# EAGLE design Smoothiepanel (EAGLE 6.4)
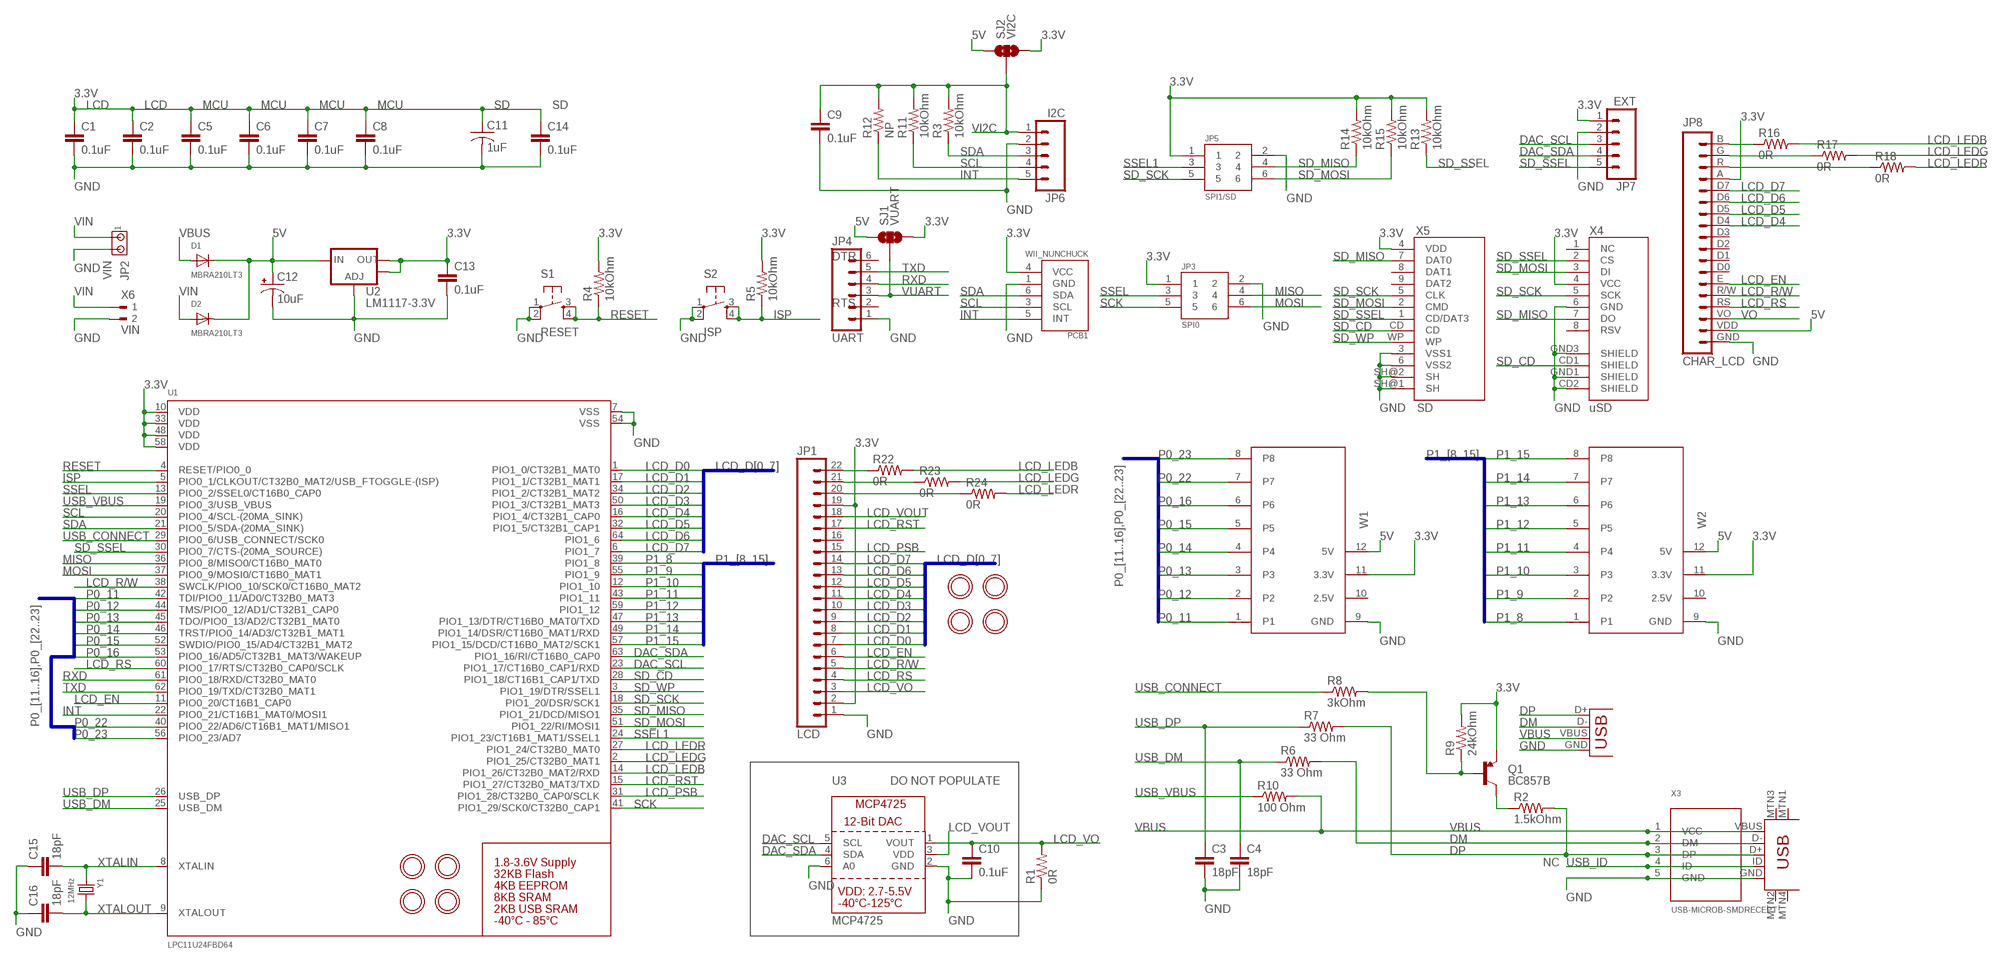
[diagram p0: schematic, sheet 1]

## Parts
C1  0.1uF  CAP0603-CAP  [0603-CAP]
C2  0.1uF  CAP0603-CAP  [0603-CAP]
C3  18pF  CAP0603-CAP  [0603-CAP]
C4  18pF  CAP0603-CAP  [0603-CAP]
C5  0.1uF  CAP0603-CAP  [0603-CAP]
C6  0.1uF  CAP0603-CAP  [0603-CAP]
C7  0.1uF  CAP0603-CAP  [0603-CAP]
C8  0.1uF  CAP0603-CAP  [0603-CAP]
C9  0.1uF  CAP0603-CAP  [0603-CAP]
C10  0.1uF  CAP0603-CAP  [0603-CAP]
C11  1uF  C-USC0805  [C0805]
C12  10uF  CAP_POL1206  [EIA3216]
C13  0.1uF  CAP0603-CAP  [0603-CAP]
C14  0.1uF  CAP0603-CAP  [0603-CAP]
C15  18pF  CAP0603-CAP  [0603-CAP]
C16  18pF  CAP0603-CAP  [0603-CAP]
D1  MBRA210LT3  DIODESMA  [SMADIODE]
D2  MBRA210LT3  DIODESMA  [SMADIODE]
JP1  LCD  M22  [1X22]
JP2  VIN  MTA02-100  [10X02MTA]
JP3  SPI0  M03X2  [2X3-SHROUDED]
JP4  UART  M06SIP  [1X06]
JP5  SPI1/SD  M03X2  [2X3-SHROUDED]
JP6  I2C  M05PTH  [1X05]
JP7  EXT  M05PTH  [1X05]
JP8  CHAR_LCD  LCD_TEXT  [TEXT_LCD]
PCB1  WII_NUNCHUCK  [WII_NUNCHUCK]
Q1  BC857B  TRANSISTOR_PNPSMD  [SOT23-3]
R1  0R  RESISTOR0603-RES  [0603-RES]
R2  1.5kOhm  RESISTOR0603-RES  [0603-RES]
R3  10kOhm  RESISTOR0603-RES  [0603-RES]
R4  10kOhm  RESISTOR0603-RES  [0603-RES]
R5  10kOhm  RESISTOR0603-RES  [0603-RES]
R6  33 Ohm  RESISTOR0603-RES  [0603-RES]
R7  33 Ohm  RESISTOR0603-RES  [0603-RES]
R8  3kOhm  RESISTOR0603-RES  [0603-RES]
R9  24kOhm  RESISTOR0603-RES  [0603-RES]
R10  100 Ohm  RESISTOR0603-RES  [0603-RES]
R11  10kOhm  RESISTOR0603-RES  [0603-RES]
R12  NP  RESISTOR0603-RES  [0603-RES]
R13  10kOhm  RESISTOR0603-RES  [0603-RES]
R14  10kOhm  RESISTOR0603-RES  [0603-RES]
R15  10kOhm  RESISTOR0603-RES  [0603-RES]
R16  0R  R-US_R0603  [R0603]
R17  0R  R-US_R0603  [R0603]
R18  0R  R-US_R0603  [R0603]
R22  0R  RESISTOR0603-RES  [0603-RES]
R23  0R  RESISTOR0603-RES  [0603-RES]
R24  0R  RESISTOR0603-RES  [0603-RES]
S1  RESET  TAC_SWITCHSMD  [TACTILE_SWITCH_SMD]
S2  ISP  TAC_SWITCHSMD  [TACTILE_SWITCH_SMD]
SJ1  VUART  SOLDERJUMPER_2WAYS  [SJ_3]
SJ2  VI2C  SOLDERJUMPER_2WAYPASTE2&3  [SJ_3_PASTE2&3]
U1  LPC11U24FBD64  LPC11U24_QFP64  [LQFP64]
U2  LM1117-3.3V  V_REG_LM1117SOT223  [SOT223]
U3  MCP4725  DAC_MCP4725  [SOT23-6]
U$4  MOUNTINGHOLE2.5_THICK  [MOUNTINGHOLE_2.5_PLATED_THICK]
U$5  MOUNTINGHOLE2.5_THICK  [MOUNTINGHOLE_2.5_PLATED_THICK]
U$6  MOUNTINGHOLE2.5_THICK  [MOUNTINGHOLE_2.5_PLATED_THICK]
U$7  MOUNTINGHOLE2.5_THICK  [MOUNTINGHOLE_2.5_PLATED_THICK]
U$8  MOUNTINGHOLE3.0THIN  [MOUNTINGHOLE_3.0_PLATEDTHIN]
U$9  MOUNTINGHOLE3.0THIN  [MOUNTINGHOLE_3.0_PLATEDTHIN]
U$10  MOUNTINGHOLE3.0THIN  [MOUNTINGHOLE_3.0_PLATEDTHIN]
U$11  MOUNTINGHOLE3.0THIN  [MOUNTINGHOLE_3.0_PLATEDTHIN]
W1  PAPILIO-WING-8BITS  [PAPILIO-WING-8BITS]
W2  PAPILIO-WING-8BITS  [PAPILIO-WING-8BITS]
X1  USB-B  USBPTH  [USB-B-PTH]
X2  mUSB  USB-MINIB-5PIN  [USB-MINIB]
X3  USB-MICROB-SMDRECEPT  [USB-MICROB-RECEPT]
X4  uSD  USD-SOCKETNEW  [MICRO-SD-SOCKET-PP]
X5  SD  SD_CARD_SOCKET4UCON  [SDCARD_4UCONN]
X6  VIN  180-2  [180-2]
Y1  12MHz  CRYSTAL2.5X2.0MM  [CRYSTAL_2.5X2]

## Nets
3.3V: C1.1 C2.1 C5.1 C6.1 C7.1 C8.1 C11.1 C13.1 C14.1 JP1.2 JP1.19 JP3.1 JP5.1 JP7.1 JP8.A PCB1.4(VCC) Q1.2(E) R4.2 R5.2 R9.2 R13.2 R14.2 R15.2 SJ1.3 SJ2.3 U1.10(VDD) U1.33(VDD) U1.48(VDD) U1.58(VDD) U2.2(OUT) U2.4(OUT) W1.11(3.3V) W2.11(3.3V) X4.4(VCC) X5.4(VDD)
5V: C12.A(+) D1.C D2.C JP8.VDD SJ1.1 SJ2.1 U2.3(IN) W1.12(5V) W2.12(5V)
DAC_SCL: JP7.3 U1.23(PIO1_17/CT16B0_CAP1/RXD) U3.5(SCL)
DAC_SDA: JP7.4 U1.63(PIO1_16/RI/CT16B0_CAP0) U3.4(SDA)
DM: R6.2 X1.D- X2.D- X3.2(DM)
DP: R2.2 R7.2 X1.D+ X2.D+ X3.3(DP)
GND: C1.2 C2.2 C3.2 C4.2 C5.2 C6.2 C7.2 C8.2 C9.2 C10.2 C11.2 C12.C(-) C13.2 C14.2 C15.1 C16.1 JP1.1 JP2.2 JP3.2 JP4.1 JP5.2 JP6.2 JP7.2 JP8.GND PCB1.1(GND) R1.1 S1.1 S1.2 S2.1 S2.2 U1.7(VSS) U1.54(VSS) U2.1(ADJ) U3.2(GND) U3.6(A0) W1.9(GND) W2.9(GND) X1.GND X2.GND X3.5(GND) X4.6(GND) X4.CD2(SHIELD) X4.GND1(SHIELD) X4.GND3(SHIELD) X5.3(VSS1) X5.6(VSS2) X5.SH@1(SH) X5.SH@2(SH) X6.2
INT: JP6.5 PCB1.5(INT) R12.1 U1.22(PIO0_21/CT16B1_MAT0/MOSI1)
ISP: R5.1 S2.3 S2.4 U1.5(PIO0_1/CLKOUT/CT32B0_MAT2/USB_FTOGGLE-(ISP))
LCD_D0: JP1.7 U1.1(PIO1_0/CT32B1_MAT0)
LCD_D1: JP1.8 U1.17(PIO1_1/CT32B1_MAT1)
LCD_D2: JP1.9 U1.34(PIO1_2/CT32B1_MAT2)
LCD_D3: JP1.10 U1.50(PIO1_3/CT32B1_MAT3)
LCD_D4: JP1.11 JP8.D4 U1.16(PIO1_4/CT32B1_CAP0)
LCD_D5: JP1.12 JP8.D5 U1.32(PIO1_5/CT32B1_CAP1)
LCD_D6: JP1.13 JP8.D6 U1.64(PIO1_6)
LCD_D7: JP1.14 JP8.D7 U1.6(PIO1_7)
LCD_EN: JP1.6 JP8.E U1.11(PIO0_20/CT16B1_CAP0)
LCD_LEDB: R16.2 R22.2 U1.14(PIO1_26/CT32B0_MAT2/RXD)
LCD_LEDB_RES: JP1.22 R22.1
LCD_LEDB_RES1: JP8.B R16.1
LCD_LEDG: R17.2 R23.2 U1.2(PIO1_25/CT32B0_MAT1)
LCD_LEDG_RES: JP1.21 R23.1
LCD_LEDG_RES1: JP8.G R17.1
LCD_LEDR: R18.2 R24.2 U1.27(PIO1_24/CT32B0_MAT0)
LCD_LEDR_RES: JP1.20 R24.1
LCD_LEDR_RES1: JP8.R R18.1
LCD_PSB: JP1.15 U1.31(PIO1_28/CT32B0_CAP0/SCLK)
LCD_R/W: JP1.5 JP8.R/W U1.38(SWCLK/PIO0_10/SCK0/CT16B0_MAT2)
LCD_RS: JP1.4 JP8.RS U1.60(PIO0_17/RTS/CT32B0_CAP0/SCLK)
LCD_RST: JP1.17 U1.15(PIO1_27/CT32B0_MAT3/TXD)
LCD_VO: C10.1 JP1.3 R1.2 U3.1(VOUT)
LCD_VOUT: JP1.18 U3.3(VDD)
MISO: JP3.4 U1.36(PIO0_8/MISO0/CT16B0_MAT0)
MOSI: JP3.6 U1.37(PIO0_9/MOSI0/CT16B0_MAT1)
P0_11: U1.42(TDI/PIO0_11/AD0/CT32B0_MAT3) W1.1
P0_12: U1.44(TMS/PIO0_12/AD1/CT32B1_CAP0) W1.2
P0_13: U1.45(TDO/PIO0_13/AD2/CT32B1_MAT0) W1.3
P0_14: U1.46(TRST/PIO0_14/AD3/CT32B1_MAT1) W1.4
P0_15: U1.52(SWDIO/PIO0_15/AD4/CT32B1_MAT2) W1.5
P0_16: U1.53(PIO0_16/AD5/CT32B1_MAT3/WAKEUP) W1.6
P0_22: U1.40(PIO0_22/AD6/CT16B1_MAT1/MISO1) W1.7
P0_23: U1.56(PIO0_23/AD7) W1.8
P1_8: U1.39(PIO1_8) W2.1
P1_9: U1.55(PIO1_9) W2.2
P1_10: U1.12(PIO1_10) W2.3
P1_11: U1.43(PIO1_11) W2.4
P1_12: U1.59(PIO1_12) W2.5
P1_13: U1.47(PIO1_13/DTR/CT16B0_MAT0/TXD) W2.6
P1_14: U1.49(PIO1_14/DSR/CT16B0_MAT1/RXD) W2.7
P1_15: U1.57(PIO1_15/DCD/CT16B0_MAT2/SCK1) W2.8
RESET: R4.1 S1.3 S1.4 U1.4(RESET/PIO0_0)
RXD: JP4.4 U1.61(PIO0_18/RXD/CT32B0_MAT0)
SCK: JP3.5 U1.41(PIO1_29/SCK0/CT32B0_CAP1)
SCL: JP6.4 PCB1.3(SCL) R11.1 U1.20(PIO0_4/SCL-(20MA_SINK))
SD_CD: U1.28(PIO1_18/CT16B1_CAP1/TXD) X4.CD1(SHIELD) X5.CD
SD_MISO: JP5.4 R14.1 U1.35(PIO1_21/DCD/MISO1) X4.7(DO) X5.7(DAT0)
SD_MOSI: JP5.6 R15.1 U1.51(PIO1_22/RI/MOSI1) X4.3(DI) X5.2(CMD)
SD_SCK: JP5.5 U1.18(PIO1_20/DSR/SCK1) X4.5(SCK) X5.5(CLK)
SD_SSEL: JP7.5 R13.1 U1.30(PIO0_7/CTS-(20MA_SOURCE)) X4.2(CS) X5.1(CD/DAT3)
SD_WP: U1.3(PIO1_19/DTR/SSEL1) X5.WP
SDA: JP6.3 PCB1.6(SDA) R3.1 U1.21(PIO0_5/SDA-(20MA_SINK))
SSEL: JP3.3 U1.13(PIO0_2/SSEL0/CT16B0_CAP0)
SSEL1: JP5.3 U1.24(PIO1_23/CT16B1_MAT1/SSEL1)
TXD: JP4.5 U1.62(PIO0_19/TXD/CT32B0_MAT1)
USB_CONNECT: R8.1 U1.29(PIO0_6/USB_CONNECT/SCK0)
USB_CONNECT_BASE: Q1.1(B) R8.2 R9.1
USB_CONNECT_COLLECTOR: Q1.3(C) R2.1
USB_DM: C4.1 R6.1 U1.25(USB_DM)
USB_DP: C3.1 R7.1 U1.26(USB_DP)
USB_ID: X2.ID X3.4(ID)
USB_VBUS: R10.1 U1.19(PIO0_3/USB_VBUS)
VBUS: D1.A R10.2 X1.VBUS X2.VBUS X3.1(VCC)
VI2C: C9.1 JP6.1 R3.2 R11.2 R12.2 SJ2.2
VIN: D2.A JP2.1 X6.1
VO: JP8.VO
VUART: JP4.3 SJ1.2
XTALIN: C15.2 U1.8(XTALIN) Y1.1
XTALOUT: C16.2 U1.9(XTALOUT) Y1.3
Unconnected: JP1.16 JP4.2 JP4.6 JP8.D0 JP8.D1 JP8.D2 JP8.D3 W1.10(2.5V) W2.10(2.5V) X2.MTN1(MTN2) X2.MTN2(MTN3) X2.MTN3(MTN1) X2.MTN4 X4.1(NC) X4.8(RSV) X5.8(DAT1) X5.9(DAT2)

## Buses
P1_[8..15]
LCD_D[0..7]
P0_[11..16],P0_[22..23]

## Notes on the sheet
- LCD | LCD | MCU | MCU | MCU | MCU | SD | SD
- DTR
- RTS
- DO NOT POPULATE
- NC

## Library data of the parts
C1-C10 C13-C16 = SparkFun-Capacitors:CAP: Capacitor Standard 0603 ceramic capacitor, and 0.1" leaded capacitor.
C11 = resistor:C-US: CAPACITOR, American symbol
C12 = SparkFun:CAP_POL: Capacitor Polarized These are standard SMD and PTH capacitors. Normally 10uF, 47uF, and 100uF in electrolytic and tantalum varieties. Always verify the external diameter of the through hole cap, it varies with capacity, voltage, and manufacturer. The EIA devices should be standard.
D1 D2 = microbuilder:DIODE: Diode SMADIODE - SMA Surface Mount Package 20V 1A Schottky Diode Digikey (500mV @ 1A, 500uA Vr @ 20V): 641-1014-6-ND 10V 2A Schottky Diode Digikey (350mV @ 2A, 700uA Vr @ 10V): MBRA210LT3 SOD-123 30V 200mA (800mV Vf, 2uA Vr @ 25V) Schottky Diode (very fast switching for boost, etc.) - Digikey: BAT54T1GOSTR-ND 30V 500mA (430mV Vf, 130uA Vr @ 30V) Schottky Diode - Digikey: B0530W-FDICT-ND MBR120 1A 20V (0.34Vf) Schottky Diode - Digikey: MBR120VLSFT1GOSCT-ND SOD-323 10V 570mA (380mV Vf, 3ns) Schottky Diode - Digikey: ZLLS410CT-ND 1N4148WS - 75V 150mA (1V Vf @ 10mA, 4ns) Simple Diode - Digikey: 1N4148WSFSCT-ND, Mouser: 512-1N4148WS SOD-523 BAT54 30V 200mA Schottky (0.8 Vf @ 100mA, 5ns) - Digikey: BAT54XV2CT-ND 30V 30mA Schottky Diode (RB751S-40TE61) - Digikey: RB751S-40TE61CT-ND SOT23-R/W - SOT23 Package (R = Solder Paste/Reflow Ovens, W = Hand-Soldering) BAT54Film 40V 300mA - Digikey: 497-7162-1-ND DO-1N4148 Through Hole Small Current Diode (any model)
JP1 = logxen:M22
JP2 = con-amp:MTA02-100: AMP connector
JP3 JP5 = SparkFun-Connectors:M03X2: Shrouded 2x3 .1" header, with keying.
JP4 = SparkFun-Connectors:M06: Header 6 Standard 6-pin 0.1" header. Use with straight break away headers (SKU : PRT-00116), right angle break away headers (PRT-00553), swiss pins (PRT-00743), machine pins (PRT-00117), and female headers (PRT-00115). Molex polarized connector foot print use with SKU : PRT-08094 with associated crimp pins and housings. NOTES ON THE VARIANTS LOCK and LOCK_LONGPADS... This footprint was designed to help hold the alignment of a through-hole component (i.e. 6-pin header) while soldering it into place. You may notice that each hole has been shifted either up or down by 0.005 of an inch from it's more standard position (which is a perfectly straight line). This slight alteration caused the pins (the squares in the middle) to touch the edges of the holes. Because they are alternating, it causes a "brace" to hold the component in place. 0.005 has proven to be the perfect amount of "off-center" position when using our standard breakaway headers. Although looks a little odd when you look at the bare footprint, once you have a header in there, the alteration is very hard to notice. Also, if you push a header all the way into place, it is covered up entirely on the bottom side. This idea of altering the position of holes to aid alignment will be further integrated into the Sparkfun Library for other footprints. It can help hold any component with 3 or more connection pins.
JP6 JP7 = SparkFun-Connectors:M05: Header 5 Standard 5-pin 0.1" header. Use with straight break away headers (SKU : PRT-00116), right angle break away headers (PRT-00553), swiss pins (PRT-00743), machine pins (PRT-00117), and female headers (PRT-00115). Molex polarized connector foot print use with SKU : PRT-08230 with associated crimp pins and housings.
JP8 = logxen:LCD_TEXT
PCB1 = logxen:WII_NUNCHUCK
Q1 = SparkFun-DiscreteSemi:TRANSISTOR_PNP: Generic PNP BJT. Double check pinouts against datasheets- not all devices are the same!
R1-R15 R22-R24 = SparkFun-Resistors:RESISTOR: Resistor Basic schematic elements and footprints for 0603, 1206, and PTH resistors.
R16-R18 = resistor:R-US_: RESISTOR, American symbol
S1 S2 = SparkFun-Electromechanical:TAC_SWITCH: Momentary Switch Button commonly used for reset or general input. Spark Fun Electronics SKU : COM-00097
SJ1 = SparkFun:SOLDERJUMPER_2WAY: Solder Jumper 2 way solder jumper
SJ2 = SparkFun-Passives:SOLDERJUMPER_2WAY: Solder Jumper 2 way solder jumper
U1 = microbuilder:LPC11U24_QFP64: LPC11U24 - ARM Cortex M0 50MHz MCU Supply: 1.8-3.6V Flash: 32KB EEPROM: 4KB SRAM: 8KB + 2KB USB Temp: -40°C - 85°C
U2 = SparkFun:V_REG_LM1117: Voltage Regulator LM1117 Standard adjustable voltage regulator but in SMD form. Spark Fun Electronics SKU : COM-00595
U3 = microbuilder:DAC_MCP4725: MCP4725 - 12-Bit I2C DAC with on-board EEPROM Settling Time: 6 µs 2.7-5.5V Supply 100kHz, 400kHz, 3.4 Mbps I²C EEPROM can be used to store a specific output voltage which will be set coming out of reset I²C Address: 1100 A2 A1 A0 A0 is set via the A0 pin, A2 and A1 are hard-wired on the chip depending on the model chosen: Part Number A2 A1 Code MCP4725A0T-E/CH 0 0 AJNN MCP4725A1T-E/CH 0 1 APNN MCP4725A2T-E/CH 1 0 AQNN MCP4725A3T-E/CH 1 1 ARNN
U$4-U$11 = microbuilder:MOUNTINGHOLE: Mounting Hole For #2 screws (0.086"/2.18mm width, 0.094"/2.4mm hole) use 2.5mm
W1 W2 = logxen:PAPILIO-WING-8BITS
X1 = SparkFun-Connectors:USB: USB Connectors USB-B-PTH is fully proven SKU : PRT-00139/CONN-08278 USB-miniB is fully proven SKU : PRT-00587 USB-A-PCB is untested. USB-A-H is throughly reviewed, but untested. Spark Fun Electronics SKU : PRT-00437 USB-B-SMT is throughly reviewed, but untested. Needs silkscreen touching up. USB-A-S has not been used/tested USB-MB-H has not been used/tested USB-MICROB has been used. CONN-09505; PROD_ID: CONN-08278
X2 = SparkFun-Connectors:USB-MINIB: Mini-USB "B" connector with 5th pin broken out. Created new symbol breaking out 5th "ID" pin in mini/micro USB connector spec. See: http://en.wikipedia.org/wiki/Mini_usb#Cables. Uses same footprint as 4-pin symbol. Also added pins to connect to mounting / shield pads if required (probably not generally needed as signals aren't shielded once they leave the connector).
X3 = logxen:USB-MICROB-SMDRECEPT
X4 = SparkFun-Connectors:USD-SOCKET: microSD Socket Push-push type uSD socket. Schematic element and footprint production proven. Spark Fun Electronics SKU : PRT-00127. tDoc lines correctly indicate media card edge positions when inserting (unlocked, locked, depressed).
X5 = SparkFun-Connectors:SD_CARD_SOCKET: SD Memory Card Connector, push-push normal type, CD enable, WP enable
X6 = con-weidmueller-sl35:180-2: WEIDMUELLER CLAMP CONNECTOR; OC_FARNELL: unknown; OC_NEWARK: unknown
Y1 = microbuilder:CRYSTAL: Crystals HC49UP - Surface Mount Crystal 4.0MHz 18pF +/-30ppm Surface Mount Crystal [Digikey: 535-9857-1-ND] 12.0 MHz Surface Mount Crystal [Digikey: 535-9869-6-ND] 25.0 MHz Surface Mount Crystal [Digikey: 535-9078-1-ND] 2.5 x 2.0mm - MEMs SMT Crystal 16.0 MHz 10pF 20ppm 2.5 x 2.0mm Crystal [Digikey -40-85°C: 535-10923-1-ND] 3.2 x 2.5mm - MEMs SMT Crystal 12.0 MHz 8pF 15ppm 3.2 x 2.5mm Crystal [Digikey: -10-70°C: 644-1047-1-ND -40-125°C: 644-1128-1-ND] 16.0 MHz 8pF 15ppm 3.2 x 2.5mm Crystal [Digikey: -10-70°C: 644-1049-1-ND -40-125°C: 644-1129-2-ND] 16.0 MHz 10pF 10ppm 3.2 x 2.5mm Crystal [Digikey: 644-1100-1-ND] 27.12 MHz 18pF 30ppm 3.2 x 2.5mm Crystal [Digikey: 887-1424-1-ND] 27.12MHz 10pF 10ppm 3.2 x 2.5mm Crystal [Digikey: 887-1329-1-ND] 4.9 x 1.8mm - MEMs SMT Crystal 32.768 KHz 12.5pF 20ppm 4.9 x 1.8mm Crystal [Digikey: SE2415CT-ND] 8.0 x 3.8mm - Surface Mount Crystal 32.768kHz 12.5pF 20ppm -40°C-85°C [Digikey: 535-9166-2-ND] Cylinder 32.768KHz Cylinder Crystal (2x6mm body) [Ex. Digikey: 300-8341-2-ND]

## Board
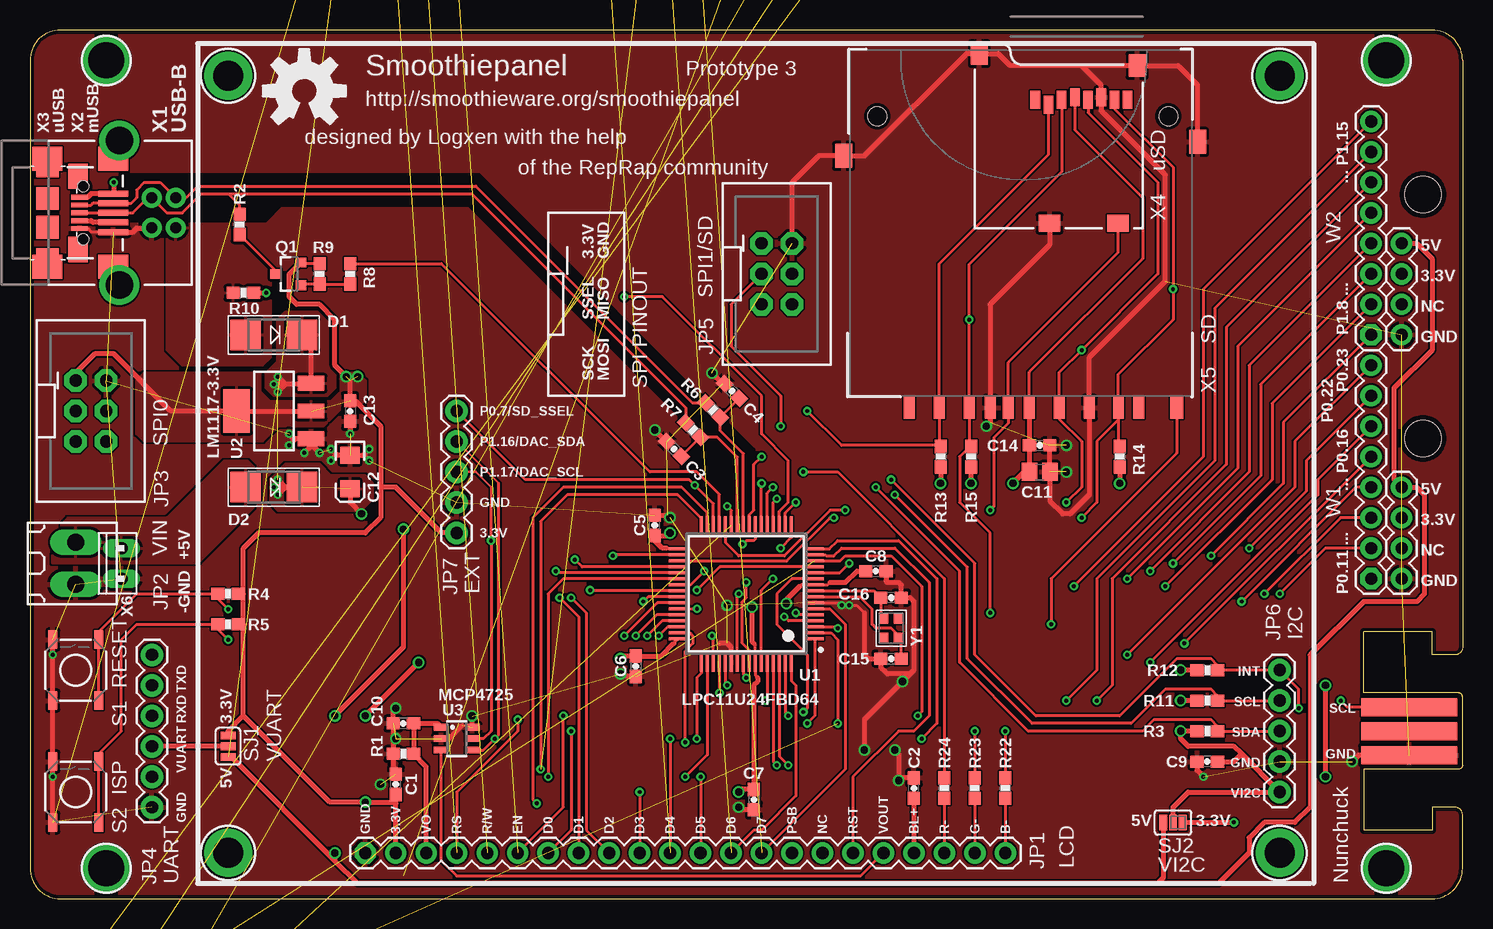
[diagram p1: board, top side]
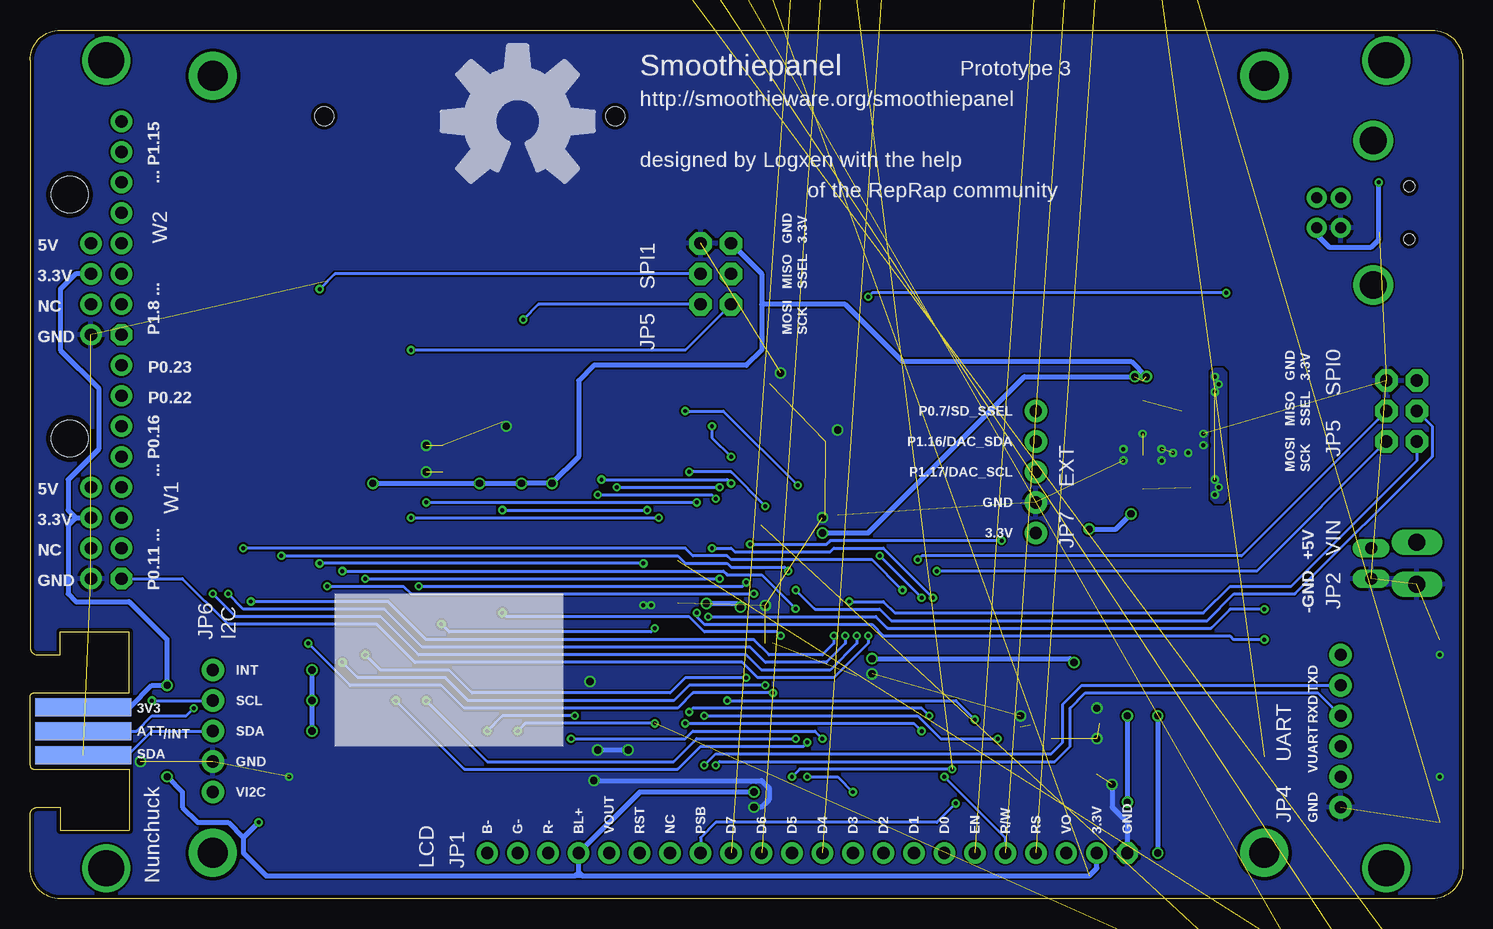
[diagram p2: board, bottom side, seen from below]

Size 119.38 x 72.39 mm. Coordinates in mm from the lower left corner, seen from the top.
Outline: 119.38,20.95 119.38,69.85 arc90 116.84,72.39 2.54,72.39 arc90 0,69.85 0,2.54 arc90 2.54,0 116.84,0 arc90 119.38,2.54 119.38,6.99
Copper layers (1*16): Top 0.0356mm / dielectric 1.5011mm / Bottom 0.0356mm
Design rules "LaenPCBOrder *": minimum track width 6mil, minimum drill 13mil, track to track 6mil, track to pad 6mil, pad to pad 6mil, via to via 6mil, smd to smd 6mil, copper to edge 12mil, drill to drill 6mil, minimum pad ring 7mil, minimum via ring 7mil, stop-mask expansion 5mil, vias tented up to drill 24mil, thermal gap 10mil

### Footprints (pad centres in the part's own frame; a part is rotated, then mirrored left to right if it is on the bottom)
0603-CAP = smd 1.1 x 1: 1 -0.85,0; 2 0.85,0
C0805 = smd 1.3 x 1.5: 1 -0.85,0; 2 0.85,0
EIA3216 = smd 1.4 x 1.6: A 1.4,0; C -1.4,0
SMADIODE = smd 2.54 x 2.54: A 2.349,0; C -2.349,0
1X22 = drill 1.016 pad 1.778 octagon: 1 0,0 | drill 1.016 pad 1.778: 2 2.54,0; 3 5.08,0; 4 7.62,0; 5 10.16,0; 6 12.7,0; 7 15.24,0; 8 17.78,0; 9 20.32,0; 10 22.86,0; 11 25.4,0; 12 27.94,0; 13 30.48,0; 14 33.02,0; 15 35.56,0; 16 38.1,0; 17 40.64,0; 18 43.18,0; 19 45.72,0; 20 48.26,0; 21 50.8,0; 22 53.34,0
10X02MTA = drill 1.016 long: 1 1.27,0; 2 -1.27,0
2X3-SHROUDED = drill 1.016 pad 1.88 octagon: 1 -1.27,2.54; 2 1.27,2.54; 3 -1.27,0; 4 1.27,0; 5 -1.27,-2.54; 6 1.27,-2.54
1X06 = drill 1.016 pad 1.88: 1 0,0; 2 2.54,0; 3 5.08,0; 4 7.62,0; 5 10.16,0; 6 12.7,0
1X05 = drill 1.016 pad 1.88: 1 0,0; 2 2.54,0; 3 5.08,0; 4 7.62,0; 5 10.16,0
TEXT_LCD = drill 1.016 pad 1.88: A 35.56,0; B 43.18,0; D0 15.24,0; D1 17.78,0; D2 20.32,0; D3 22.86,0; D4 25.4,0; D5 27.94,0; D6 30.48,0; D7 33.02,0; E 12.7,0; G 40.64,0; R 38.1,0; R/W 10.16,0; RS 7.62,0; VDD 2.54,0; VO 5.08,0 | drill 1.016 pad 1.88 square: GND 0,0
WII_NUNCHUCK = smd 8 x 1.5: 1 4.445,2; 2 4.445,0; 3 4.445,-2 | smd 8 x 1.5 bottom: 4 4.445,-2; 5 4.445,0; 6 4.445,2
SOT23-3 = smd 0.8 x 0.9: 1 -0.95,-1; 2 0.95,-1; 3 0,1.1
0603-RES = smd 1.1 x 1: 1 -0.85,0; 2 0.85,0
R0603 = smd 1 x 1.1: 1 -0.85,0; 2 0.85,0
TACTILE_SWITCH_SMD = smd 1.524 x 0.762: 1 -2.54,1.905; 2 2.54,1.905; 3 -2.54,-1.905; 4 2.54,-1.905
SJ_3 = smd 0.635 x 1.27: 1 -0.889,0; 2 0,0; 3 0.889,0
SJ_3_PASTE2&3 = smd 0.635 x 1.27: 1 -0.813,0; 2 0,0; 3 0.813,0
LQFP64 = smd 1.55 x 0.25: 1 -5.7,3.75; 2 -5.7,3.25; 3 -5.7,2.75; 4 -5.7,2.25; 5 -5.7,1.75; 6 -5.7,1.25; 7 -5.7,0.75; 8 -5.7,0.25; 9 -5.7,-0.25; 10 -5.7,-0.75; 11 -5.7,-1.25; 12 -5.7,-1.75; 13 -5.7,-2.25; 14 -5.7,-2.75; 15 -5.7,-3.25; 16 -5.7,-3.75; 33 5.7,-3.75; 34 5.7,-3.25; 35 5.7,-2.75; 36 5.7,-2.25; 37 5.7,-1.75; 38 5.7,-1.25; 39 5.7,-0.75; 40 5.7,-0.25; 41 5.7,0.25; 42 5.7,0.75; 43 5.7,1.25; 44 5.7,1.75; 45 5.7,2.25; 46 5.7,2.75; 47 5.7,3.25; 48 5.7,3.75 | smd 0.25 x 1.55: 17 -3.75,-5.7; 18 -3.25,-5.7; 19 -2.75,-5.7; 20 -2.25,-5.7; 21 -1.75,-5.7; 22 -1.25,-5.7; 23 -0.75,-5.7; 24 -0.25,-5.7; 25 0.25,-5.7; 26 0.75,-5.7; 27 1.25,-5.7; 28 1.75,-5.7; 29 2.25,-5.7; 30 2.75,-5.7; 31 3.25,-5.7; 32 3.75,-5.7; 49 3.75,5.7; 50 3.25,5.7; 51 2.75,5.7; 52 2.25,5.7; 53 1.75,5.7; 54 1.25,5.7; 55 0.75,5.7; 56 0.25,5.7; 57 -0.25,5.7; 58 -0.75,5.7; 59 -1.25,5.7; 60 -1.75,5.7; 61 -2.25,5.7; 62 -2.75,5.7; 63 -3.25,5.7; 64 -3.75,5.7
SOT223 = smd 1.219 x 2.235: 1 -2.311,-3.099; 2 0,-3.099; 3 2.311,-3.099 | smd 3.6 x 2.2: 4 0,3.099
SOT23-6 = smd 0.55 x 1.2: 1 -0.95,-1.3; 2 0,-1.3; 3 0.95,-1.3; 4 0.95,1.3; 5 0,1.3; 6 -0.95,1.3
MOUNTINGHOLE_2.5_PLATED_THICK = drill 2.5 pad 4: P$1 0,0
MOUNTINGHOLE_3.0_PLATEDTHIN = drill 3 pad 3.6: P$1 0,0
PAPILIO-WING-8BITS = drill 1.016 pad 1.778 octagon: 1 0,0 | drill 1.016 pad 1.778: 2 0,2.54; 3 0,5.08; 4 0,7.62; 5 0,10.16; 6 0,12.7; 7 0,15.24; 8 0,17.78; 9 2.54,0; 10 2.54,2.54; 11 2.54,5.08; 12 2.54,7.62 | hole 3.048: 4.318,11.684
USB-B-PTH = drill 0.914 pad 1.676: D+ 0,1.25; D- 1.981,1.25; GND 0,-1.25; VBUS 1.981,-1.25 | drill 2.286: S1 -2.718,-6.02; S2 -2.718,6.02
USB-MINIB = smd 2.5 x 0.5: D+ 2.5,0; D- 2.5,0.8; GND 2.5,-1.6; ID 2.5,-0.8; VBUS 2.5,1.6 | smd 2.5 x 2: MTN1 -3,4.5; MTN2 2.5,4.5; MTN3 -3,-4.5; MTN4 2.5,-4.5 | hole 0.9: 0,2.2; 0,-2.2
USB-MICROB-RECEPT = smd 0.4 x 1.35: 1 -1.3,4.125; 2 -0.65,4.125; 3 0,4.125; 4 0.65,4.125; 5 1.3,4.125 | smd 2.1 x 1.6: P$1 3.05,4; P$2 -3.05,4 | smd 1.8 x 1.9: P$3 -3.85,1.45; P$4 3.85,1.45 | smd 1.9 x 1.9: P$5 -1.2,1.45; P$6 1.2,1.45
MICRO-SD-SOCKET-PP = smd 0.8 x 1.5: 1 -8.94,10.7; 2 -7.84,10.3; 3 -6.74,10.7; 4 -5.64,10.9; 5 -4.54,10.7; 6 -3.44,10.9; 7 -2.34,10.7; 8 -1.24,10.7 | smd 1.8 x 1.4: CD1 -2.05,0.4; CD2 -7.75,0.4 | smd 1.4 x 1.9: GND1 -13.6,14.55; GND3 -0.45,13.55
SDCARD_4UCONN = smd 1.8 x 0.9: 1 -1,6.77; 2 -1,4.27; 3 -1,2.52; 4 -1,-0.73; 5 -1,-3.23; 6 -1,-5.73; 7 -1,-8.15; 8 -1,-9.85; 9 -1,9.27; CD -1,1.02 | smd 2 x 1.4: SH@1 20,14.75; SH@2 21.15,-14.75 | smd 1.8 x 1.1: WP -1,-13 | hole 1.55: 23.3,11.94; 23.3,-12.32
180-2 = drill 1.422 long: 1 -1.75,0; 2 1.75,0
CRYSTAL_2.5X2 = smd 0.9 x 0.8: 1 -0.825,-0.625; 2 0.825,-0.625; 3 0.825,0.625; 4 -0.825,0.625

### Placement (x,y rotation side)
C1  30.48,9.53 90 top
C2  73.66,9.21 90 top
C3  53.67,37.48 135 top
C4  58.5,42.3 135 top
C5  52.07,31.11 90 top
C6  50.48,19.37 270 top
C7  60.33,8.26 270 top
C8  70.48,27.3 0 top
C9  98.11,11.43 180 top
C10  31.11,14.61 180 top
C11  84.14,35.56 0 top
C12  26.67,35.56 270 top
C13  26.67,40.64 270 top
C14  84.14,37.78 0 top
C15  71.75,20 0 top
C16  71.75,25.08 180 top
D1  20.32,46.99 180 top
D2  20.32,34.29 180 top
JP1  27.94,3.81 0 top
JP2  7.62,27.94 90 top
JP3  5.08,40.64 0 top
JP4  10.16,7.62 90 top
JP5  62.23,52.07 0 top
JP6  104.14,8.89 90 top
JP7  35.56,30.48 90 top
JP8  22.86,77.47 0 top  (outside the outline)
PCB1  119.38,13.97 180 top
Q1  21.59,52.07 90 top
R1  31.11,12.06 0 top
R2  17.46,56.2 90 top
R3  98.11,13.97 180 top
R4  16.51,25.4 0 top
R5  16.51,22.86 0 top
R6  56.93,40.73 135 top
R7  55.24,39.05 135 top
R8  26.67,52.07 270 top
R9  24.13,52.07 90 top
R10  17.78,50.48 180 top
R11  98.11,16.51 180 top
R12  98.11,19.05 180 top
R13  75.88,36.83 270 top
R14  90.81,36.83 270 top
R15  78.42,36.83 270 top
R16  0,-12.7 0 top  (outside the outline)
R17  5.08,-12.7 0 top  (outside the outline)
R18  10.16,-12.7 0 top  (outside the outline)
R22  81.28,9.21 90 top
R23  78.74,9.21 90 top
R24  76.2,9.21 90 top
S1  3.81,19.05 90 top
S2  3.81,8.89 90 top
SJ1  16.51,12.7 90 top
SJ2  95.25,6.35 0 top
U1  59.69,25.4 180 top
U2  20.32,40.64 90 top
U3  35.56,13.34 270 top
U$1  [OSHW-LOGO-HUGE]  78.74,64.77 0 bottom
U$2  [OSHW-LOGO-L]  22.86,67.31 0 top
U$4  16.51,3.81 0 top
U$5  104.14,3.81 0 top
U$6  16.51,68.58 0 top
U$7  104.14,68.58 0 top
U$8  113.03,2.54 0 top
U$9  113.03,69.85 0 top
U$10  6.35,2.54 0 top
U$11  6.35,69.85 0 top
W1  111.76,26.67 0 top
W2  111.76,46.99 0 top
X1  10.16,57.15 0 top
X2  4.45,57.15 0 top
X3  0,57.15 270 top
X4  92.71,55.88 0 top
X5  82.55,41.91 90 top
X6  3.81,27.94 270 top
Y1  71.75,22.54 90 top

### Tracks (layer width: path | path; a pad name or v marks a point on that pad's centre or on a via)
3.3V  (via drill 0.33, 0.6)  (4 unrouted)
  Top 0.254: X4.4 87.07,64.06 92.71,58.42 92.71,53.34 83.28,43.91 X5.4 | R9.2 22.69,52.92 Q1.2 | U1.33 53.08,29.15 53.02,29.21 | 66.67,26.35 66.47,26.15 U1.10 64.25,26.15 64.14,26.04 | 60.33,21.27 60.44,21.16 U1.58 60.44,18.62 60.64,18.41 | U1.48 53.99,21.61 53.66,21.27
  Top 0.406: U2.2 U2.4 11.75,40.64 6.99,45.4 5.4,45.4 3.81,43.81 JP3.1 | C2.1 JP1.19 | JP1.2 30.48,7.94 | 30.48,7.94 C1.1 | Q1.2 21.59,52.02 21.59,50.16 22.23,49.53 24.13,49.53 25.4,48.26 25.4,44.45 26.67,43.18 C13.1 27.09,41.49 29.21,39.37 29.21,34.29 | 29.21,34.29 29.21,31.75 27.94,30.48 19.05,30.48 17.78,29.21 17.78,25.4 | 17.78,15.24 16.51,13.97 SJ1.3 | 17.78,15.24 17.78,22.86 | 17.78,22.86 17.78,25.4 | 17.78,15.24 24.98,8.04 v27.94,8.04 30.38,8.04 30.48,7.94 | R4.2 17.78,25.4 | R5.2 17.78,22.86 | 53.02,29.21 52.7,29.21 52.07,29.84 C5.1 53.12,30.27 v53.34,30.48 | v107.95,17.78 v107.95,10.16 | v78.42,34.61 R15.2 | R14.2 v90.81,34.61 | X5.4 C14.1 C11.1 82.87,35.56 v81.92,34.61 | 66.67,26.35 67.94,26.35 68.9,27.3 C8.1 | v32.38,19.68 v27.94,15.24 | v59.05,8.89 59.27,9.11 C7.1 60.33,17.78 60.64,18.1 60.64,18.41 | v60.17,24.29 60.17,21.43 60.33,21.27 | 64.14,26.04 63.02,24.92 v63.02,24.61 | JP7.1 34.29,30.48 30.48,34.29 29.21,34.29 | v49.21,20 49.43,20.22 C6.1 52.6,20.22 53.66,21.27 | R13.2 v75.88,34.61 | SJ2.3 v100.33,6.35
  Bottom 0.406: W2.11 115.57,52.07 116.84,50.8 116.84,45.72 113.67,42.55 113.67,37.47 116.2,34.92 116.2,32.38 115.57,31.75 | 115.57,31.75 W1.11 | 115.57,31.75 116.2,31.11 116.2,25.4 115.57,24.77 111.12,24.77 107.95,21.59 v107.95,17.78 109.22,17.78 111.03,15.97 PCB1.4 | v107.95,10.16 106.68,8.89 106.68,7.62 105.41,6.35 102.87,6.35 101.6,5.08 | 101.6,5.08 101.6,3.81 99.69,1.91 73.98,1.91 | 73.98,1.91 73.66,2.22 | 73.66,2.22 JP1.19 68.58,8.89 v59.05,8.89 | 73.66,2.22 73.34,1.91 | 73.34,1.91 73.98,1.91 | 73.34,1.91 31.11,1.91 30.48,2.54 JP1.2 | v90.81,34.61 v81.92,34.61 v78.42,34.61 v75.88,34.61 73.66,36.83 73.66,43.18 72.39,44.45 59.69,44.45 58.42,45.72 58.42,49.53 | JP5.1 58.42,52.07 58.42,49.53 | 58.42,49.53 51.44,49.53 46.67,44.77 27.62,44.77 v26.35,43.5 | v53.34,30.48 49.53,30.48 36.51,43.5 v27.3,43.5 | v49.21,20 32.7,20 v32.38,19.68 | v27.94,15.24 v27.94,8.04 | v63.02,24.61 60.48,24.61 v60.17,24.29 | v100.33,6.35 101.6,5.08
  pour Top (isolate 0.254, rank 2): 8.89,38.73 8.89,43.18 9.53,43.81 27.3,43.81 27.94,43.18 27.94,41.59 27.3,40.96 26.04,40.96 24.45,39.37 20.64,39.37 19.37,38.1 9.53,38.1
5V  (via drill 0.33, 0.6)  (3 unrouted)
  Top 0.406: D1.C 23.42,46.24 U2.3 22.95,42.95 22.86,42.86 21.27,42.86 | D2.C 21.27,34.29 | 21.27,34.29 v20.64,34.92 | 21.27,34.29 v20.64,33.66 | 21.27,34.29 v20.32,34.29 | 21.27,42.86 v20.64,43.5 | 21.27,42.86 v20.64,42.23 | 21.27,42.86 v20.32,42.86 | W2.12 115.57,54.61 116.84,53.34 116.84,45.72 113.67,42.55 113.67,34.92 W1.12 115.57,34.29 116.2,33.66 116.2,25.4 115.57,24.77 111.12,24.77 106.68,20.32 106.68,7.62 105.41,6.35 102.87,6.35 101.6,5.08 101.6,3.81 99.06,1.27 93.98,1.27 | 93.98,1.27 27.3,1.27 25.4,3.17 | C12.A 26.67,33.02 v27.62,32.07 | v31.11,30.8 31.11,20.95 v25.4,15.24 | v25.4,3.81 25.4,3.17 | SJ1.1 16.76,11.81 25.4,3.17 | SJ2.1 94.44,1.73 93.98,1.27
  Bottom 0.406: v25.4,15.24 v25.4,3.81 | v31.11,30.8 28.89,30.8 v27.62,32.07
  pour Top (isolate 0.254): 21.27,48.9 24.13,48.9 24.77,48.26 24.77,46.35 25.4,45.72 25.4,42.55 24.77,41.91 20.32,41.91 19.68,42.55 19.68,43.81 20.64,44.77 20.64,48.26
  pour Top (isolate 0.254): 20.64,32.38 27.62,32.38 28.57,33.34 28.57,34.61 27.94,35.24 25.08,35.24 24.13,36.2 21.27,36.2 20,34.92 20,33.02
  pour Bottom (isolate 0.254): 20,44.13 20.64,44.13 20.95,43.81 20.95,33.34 20.64,33.02 20,33.02 19.68,33.34 19.68,43.81
DAC_SCL  (via drill 0.33)
  Top 0.203: JP7.3 37.15,35.56 38.42,34.29 38.42,32.7
  Top 0.254: U1.23 60.44,29.96 60.33,29.84 59.69,29.84 v59.37,29.53 | U3.5 37.78,13.34 38.42,13.97 v38.42,29.84 38.42,32.7
  Bottom 0.254: v38.42,29.84 52.7,29.84 53.02,29.53 v59.37,29.53
DAC_SDA  (via drill 0.33)
  Top 0.203: JP7.4 39.05,34.61
  Top 0.254: U1.63 62.94,15.48 v63.18,15.24 | U3.4 37.78,12.38 v38.73,13.34 39.05,13.65 39.05,34.61
  Bottom 0.254: v63.18,15.24 45.4,15.24 43.5,13.34 v38.73,13.34
DM
  Top 0.254: X3.2 5.09,57.8 5.25,57.95 X2.D- 8.42,57.95 8.89,58.42 8.89,59.05 9.53,59.69 10.85,59.69 X1.D- 12.16,58.42 13.02,58.42 13.97,59.37 37.15,59.37 55.19,41.33 R6.2
DP
  Top 0.254: X3.3 X2.D+ 8.57,57.15 9.82,58.4 X1.D+ 11.41,57.15 12.7,57.15 14.29,58.74 16.51,58.74 | 16.51,58.74 36.83,58.74 54.64,40.92 R7.2 | R2.2 17.46,57.78 16.51,58.74
GND  (via drill 0.33, 0.6)  (31 unrouted)
  Top 0.254: X3.5 4.79,55.85 5.09,55.55 X2.GND | U1.54 58.44,20.62 58.42,20.64 | U1.7 67.42,24.65 v67.63,24.45 | v68.26,24.45 68.9,24.45 69.53,23.81
  Top 0.406: S2.1 v1.91,10.16 S2.2 S1.1 v1.91,20.32 S1.2 | U2.1 22,38.33 | 22,38.33 v21.59,38.73 | 22,38.33 22,38.19 v21.59,37.78 | U2.1 23.42,37.71 v22.86,37.15 | U2.1 23.42,37.86 v24.13,37.15 | 25.53,36.96 C12.C 27.81,36.96 | 25.53,36.96 v25.08,36.51 | 25.53,36.96 25.53,37.02 v25.08,37.47 | 27.81,36.96 v28.26,36.51 | 27.81,36.96 27.81,37.02 v28.26,37.47 | C13.2 v26.67,38.73 | PCB1.1 110.71,11.97 v110.17,11.43 | 58.42,20.64 58.42,20.95 58.1,21.27 57.47,21.27 | C5.2 53.12,31.96 v53.34,31.75 | JP5.2 63.5,59.69 65.72,61.91 X5.SH@1 69.53,61.91 78.05,70.43 X4.GND1 80.7,70.43 81.7,69.43 87.63,69.43 | 87.63,69.43 X4.GND3 95.67,69.43 97.3,67.8 X5.SH@2 | 87.63,69.43 89.27,67.79 X4.6 89.27,65.67 94.61,60.33 94.61,51.44 88.28,45.1 X5.6 88.28,33.67 86.68,32.07 86.04,32.07 84.99,33.12 C11.2 C14.2 | X4.CD2 84.96,54.48 80.01,49.53 80.01,40.93 X5.3 80.03,39.71 v79.69,39.37 | X2.GND 8.56,55.55 8.89,55.88 10.14,55.88 X1.GND | C1.2 30.48,10.79 30.27,11.01 R1.1 C10.2 30.27,15.66 v30.48,15.88 | U3.2 34.92,13.34 36.04,14.45 | C2.2 72.61,10.06 v72.39,9.84 72.39,12.06 v72.07,12.38 | C7.2 59.27,7.41 v59.05,7.62 | v67.63,24.45 v68.26,24.45 | C8.2 71.33,26.45 71.44,26.35 72.39,26.35 72.61,26.14 C16.1 73.34,25.08 73.66,24.77 73.66,19.05 73.34,18.73 | 73.34,18.73 71.44,18.73 70.91,19.27 C15.1 69.85,20 69.53,20.32 69.53,23.81 | 73.34,18.73 v72.71,18.1 69.53,14.92 v69.53,12.38 | U3.6 36.86,15.21 v36.83,15.24 | C6.2 49.43,18.52 v49.21,18.73 | C9.2 97.26,10.69 v97.79,10.16 | C3.2 53.04,38.08 v52.07,39.05 | C4.2 57.74,42.91 v56.83,43.81
  Bottom 0.406: v72.39,9.84 58.42,9.84 57.78,9.21 57.78,8.26 58.42,7.62 v59.05,7.62 | v69.53,12.38 v72.07,12.38 | v29.21,9.53 29.21,7.62 27.94,6.35 JP1.1
  other vias: 86.36,35.56 86.36,37.78 30.48,13.34 58.1,24.45
  pour Top (rank 6): -2.54,74.93 121.92,74.93 121.92,-2.54 -2.54,-2.54
  pour Bottom (rank 6): -1.27,73.66 120.65,73.66 120.65,-1.27 -1.27,-1.27
INT  (via drill 0.33)
  Top 0.254: v105.73,15.88 105.73,17.46 JP6.5 R12.1 98.96,19.47 98.42,20 95.57,20 90.81,15.24 83.82,15.24 78.74,20.32 78.74,27.94 v71.75,34.92 | v60.96,34.61 60.96,34.29 60.94,34.27 U1.22
  Bottom 0.254: PCB1.5 110.49,13.97 109.22,15.24 106.36,15.24 v105.73,15.88 | v71.75,34.92 61.28,34.92 v60.96,34.61
ISP  (via drill 0.33)
  Top 0.254: S2.3 S2.4 5.71,12.06 7.62,13.97 7.62,21.59 8.89,22.86 R5.1 15.66,22.44 v16.51,21.59 | U1.5 63.98,23.65 v63.82,23.81
  Bottom 0.254: v16.51,21.59 19.05,21.59 19.37,21.91 48.26,21.91 49.21,22.86 63.18,22.86 63.82,23.5 v63.82,23.81
LCD_D0  (via drill 0.33)
  Top 0.254: U1.1 65.39,15.22 v64.77,14.61 | v45.09,13.97 45.09,5.71 JP1.7
  Bottom 0.254: v64.77,14.61 45.72,14.61 v45.09,13.97
LCD_D1  (via drill 0.33)
  Top 0.254: U1.17 63.44,30.1 v62.55,29.21 | v44.13,25.08 45.72,23.5 JP1.8
  Bottom 0.254: v62.55,29.21 60.96,29.21 60.64,28.89 52.7,28.89 52.39,29.21 48.26,29.21 v44.13,25.08
LCD_D2  (via drill 0.33)
  Top 0.254: U1.34 48.65,28.65 v48.58,28.57 | v45.09,25.08 46.35,23.81 46.35,5.71 JP1.9
  Bottom 0.254: v48.58,28.57 v45.09,25.08
LCD_D3  (via drill 0.33)
  Top 0.254: U1.50 56.44,11.99 v54.61,10.16 | v50.8,8.89 JP1.10
  Bottom 0.254: v54.61,10.16 52.07,10.16 v50.8,8.89
LCD_D4  (via drill 0.33)  (1 unrouted)
  Top 0.254: U1.16 66.61,29.15 67.31,29.84 72.39,29.84 75.56,26.67 75.56,14.61 v74.3,13.34 | v53.34,13.34 JP1.11
  Bottom 0.254: v74.3,13.34 64.77,13.34 64.14,13.97 53.98,13.97 v53.34,13.34
LCD_D5  (via drill 0.33)  (1 unrouted)
  Top 0.254: U1.32 55.94,31.69 53.98,33.66 44.77,33.66 42.55,31.43 v42.55,10.79 | v55.88,10.16 JP1.12
  Bottom 0.254: v42.55,10.79 55.24,10.79 v55.88,10.16
LCD_D6  (1 unrouted)
  Top 0.254: U1.64 63.44,18.16 63.82,17.78 63.82,8.57 60.96,5.71 60.33,5.71 JP1.13
LCD_D7  (1 unrouted)
  Top 0.254: U1.6 66.66,24.15 67.94,22.86 67.94,10.79 JP1.14
LCD_EN  (via drill 0.33)  (1 unrouted)
  Top 0.254: JP1.6 44.45,7.62 v44.45,15.24 | U1.11 63.48,26.65 62.23,25.4 62.23,22.86 64.77,20.32 64.77,15.88 v64.45,15.56
  Bottom 0.254: v44.45,15.24 45.09,15.88 64.14,15.88 v64.45,15.56
LCD_LEDB  (via drill 0.33)  (1 unrouted)
  Top 0.254: U1.14 67.52,28.15 67.94,28.57 71.75,28.57 74.3,26.04 74.3,15.56 v73.98,15.24 | v81.28,13.97 R22.2
  Bottom 0.254: v73.98,15.24 80.01,15.24 v81.28,13.97
LCD_LEDB_RES
  Top 0.254: R22.1 JP1.22
LCD_LEDB_RES1  (1 unrouted)
LCD_LEDG  (via drill 0.33)  (1 unrouted)
  Top 0.254: v78.74,13.97 R23.2 | U1.2 66.75,22.15 67.31,21.59 v67.31,14.61
  Bottom 0.254: v78.74,13.97 78.11,14.61 v67.31,14.61
LCD_LEDG_RES
  Top 0.254: R23.1 JP1.21
LCD_LEDG_RES1  (1 unrouted)
LCD_LEDR  (via drill 0.33)  (1 unrouted)
  Top 0.254: U1.27 58.44,32.37 v58.1,32.7 | v64.45,35.56 67.31,35.56 76.2,26.67 R24.2
  Bottom 0.254: v58.1,32.7 60.96,35.56 v64.45,35.56
LCD_LEDR_RES
  Top 0.254: R24.1 JP1.20
LCD_LEDR_RES1  (1 unrouted)
LCD_PSB  (via drill 0.33)
  Top 0.254: U1.31 56.44,32.14 54.29,34.29 44.45,34.29 41.91,31.75 41.91,8.26 v42.23,7.94
  Bottom 0.254: v42.23,7.94 43.81,6.35 62.23,6.35 63.5,5.08 JP1.15
LCD_R/W  (via drill 0.33)  (1 unrouted)
  Top 0.254: U1.38 44.43,26.65 43.18,25.4 v43.18,10.16
  Bottom 0.254: v43.18,10.16 38.1,5.08 JP1.5
LCD_RS  (via drill 0.33)  (1 unrouted)
  Top 0.254: U1.60 61.44,16.67 v61.28,16.51 | v40.64,14.92 40.64,13.97 35.56,8.89 JP1.4
  Bottom 0.254: v61.28,16.51 42.23,16.51 v40.64,14.92
LCD_RST
  Top 0.254: JP1.17 68.58,10.16 72.39,13.97 73.66,13.97 74.93,15.24 74.93,26.35 72.07,29.21 67.63,29.21 66.99,28.57 66.36,28.57 66.28,28.65 U1.15
LCD_VO
  Top 0.406: U3.1 33.94,14.61 C10.1 R1.2 33.02,11.01 JP1.3
LCD_VOUT
  Top 0.254: JP1.18 69.22,1.91 35.56,1.91 34.29,3.17 34.29,12.36 U3.3
MISO  (via drill 0.33)
  Top 0.254: U1.36 46.01,27.65 v45.4,28.26
  Bottom 0.254: JP3.4 18.41,28.57 45.09,28.57 v45.4,28.26
MOSI  (via drill 0.33)
  Top 0.254: U1.37 43.97,27.15 v43.81,27.3
  Bottom 0.254: JP3.6 17.14,27.3 v43.81,27.3
P0_11  (via drill 0.33)
  Top 0.254: U1.42 52.27,24.65 v49.53,21.91
  Bottom 0.254: W1.1 106.68,26.67 102.87,22.86 90.49,22.86 87.31,19.68 60.01,19.68 58.74,18.41 52.39,18.41 49.53,21.27 v49.53,21.91
P0_12  (via drill 0.33)
  Top 0.254: W1.2 107.95,29.21 v104.14,25.4 | U1.44 52.23,23.65 v50.48,21.91
  Bottom 0.254: v50.48,21.91 50.48,21.27 52.7,19.05 58.42,19.05 59.69,20.32 87,20.32 90.17,23.5 102.23,23.5 v104.14,25.4
P0_13  (via drill 0.33)
  Top 0.254: W1.3 109.22,31.75 v102.87,25.4 | U1.45 52.68,23.15 v51.44,21.91
  Bottom 0.254: v51.44,21.91 51.44,21.27 53.02,19.68 58.1,19.68 59.37,20.95 86.68,20.95 89.85,24.13 101.6,24.13 v102.87,25.4
P0_14  (via drill 0.33)
  Top 0.254: W1.4 110.49,34.29 v100.97,24.77 | U1.46 53.13,22.65 v52.39,21.91
  Bottom 0.254: v52.39,21.91 52.39,21.27 53.34,20.32 57.78,20.32 59.05,21.59 86.36,21.59 89.53,24.77 v100.97,24.77
P0_15  (via drill 0.33)
  Top 0.254: W1.5 v96.2,21.27 | U1.52 57.44,17.17 v57.47,17.14
  Bottom 0.254: v57.47,17.14 64.14,17.14 65.41,15.88 83.19,15.88 85.09,17.78 92.71,17.78 v96.2,21.27
P0_16  (via drill 0.33)
  Top 0.254: W1.6 107.31,34.92 107.31,33.66 v93.34,19.68 | U1.53 57.94,17.94 v58.1,17.78
  Bottom 0.254: v58.1,17.78 64.45,17.78 65.72,16.51 82.87,16.51 84.77,18.41 92.08,18.41 v93.34,19.68
P0_22  (via drill 0.33)
  Top 0.254: W1.7 106.36,36.51 106.36,33.97 v101.6,29.21 | U1.40 46.74,25.65 v46.67,25.72
  Bottom 0.254: v46.67,25.72 49.21,28.26 60.96,28.26 61.28,28.57 64.14,28.57 64.77,29.21 v101.6,29.21
P0_23  (via drill 0.33)
  Top 0.254: W1.8 105.41,38.1 105.41,34.29 v91.44,20.32 | U1.56 59.44,18.66 v59.69,18.41
  Bottom 0.254: v59.69,18.41 64.77,18.41 66.04,17.14 82.55,17.14 84.45,19.05 90.17,19.05 v91.44,20.32
P1_8  (via drill 0.33)
  Top 0.254: W2.1 104.46,39.69 104.46,34.61 v98.42,28.57 | U1.39 55.04,26.15 v56.2,27.3
  Bottom 0.254: v98.42,28.57 65.41,28.57 64.77,27.94 61.28,27.94 60.96,27.62 56.52,27.62 v56.2,27.3
P1_9  (via drill 0.33)
  Top 0.254: W2.2 103.5,41.27 103.5,34.92 v94.61,26.04 | U1.55 58.94,25.29 v59.05,25.4
  Bottom 0.254: v94.61,26.04 88.27,26.04 87.63,25.4 v59.05,25.4
P1_10  (via drill 0.33)
  Top 0.254: W2.3 102.55,42.86 102.55,35.24 v95.25,27.94 | U1.12 67.47,27.15 v68.26,27.94
  Bottom 0.254: v68.26,27.94 v95.25,27.94
P1_11  (via drill 0.33)
  Top 0.254: W2.4 101.6,44.45 101.6,35.56 v93.34,27.3 | U1.43 v55.58,24.15
  Bottom 0.254: v93.34,27.3 61.59,27.3 61.28,26.99 58.42,26.99 v55.58,24.15
P1_12  (via drill 0.33)
  Top 0.254: W2.5 100.65,46.04 100.65,35.88 v91.44,26.67 | U1.59 60.94,25.7 v61.91,26.67
  Bottom 0.254: v91.44,26.67 v61.91,26.67
P1_13  (via drill 0.33)
  Top 0.254: W2.6 99.69,47.62 99.69,36.2 90.17,26.67 90.17,17.78 v88.9,16.51 | v54.61,13.02 54.61,20.64 55.24,21.27 55.24,21.91 55,22.15 U1.47
  Bottom 0.254: v88.9,16.51 83.19,10.79 65.41,10.79 63.5,12.7 54.93,12.7 v54.61,13.02
P1_14  (via drill 0.33)
  Top 0.254: W2.7 98.74,49.21 98.74,36.51 88.9,26.67 88.9,19.05 v86.36,16.51 | U1.49 55.94,18.79 55.56,18.41 v55.56,13.34
  Bottom 0.254: v86.36,16.51 81.28,11.43 65.72,11.43 63.82,13.34 v55.56,13.34
P1_15  (via drill 0.33)
  Top 0.254: W2.8 97.79,50.8 97.79,36.83 v87,26.04 | U1.57 59.94,20.7 59.37,21.27 59.37,24.77 59.69,25.08 v59.69,26.35
  Bottom 0.254: v87,26.04 60.01,26.04 v59.69,26.35
RESET  (via drill 0.33)
  Top 0.254: S1.3 S1.4 5.71,22.23 8.89,25.4 R4.1 15.66,24.98 v16.51,24.13 | U1.4 63.21,23.15 v62.87,23.5
  Bottom 0.254: v16.51,24.13 19.37,24.13 20.95,22.54 47.94,22.54 48.9,23.5 v62.87,23.5
RXD  (via drill 0.33)
  Top 0.254: U1.61 61.94,11.4 v62.23,11.11
  Bottom 0.254: v62.23,11.11 61.91,11.43 33.97,11.43 32.7,12.7 32.7,15.88 31.43,17.14 12.06,17.14 JP4.4
SCK  (via drill 0.33)
  Top 0.254: U1.41 51.5,25.15 v51.12,24.77
  Bottom 0.254: JP3.5 3.81,36.51 14.29,26.04 19.37,26.04 21.59,23.81 47.31,23.81 48.26,24.77 v51.12,24.77
SCL  (via drill 0.33)
  Top 0.254: PCB1.3 109.76,15.97 v109.22,16.51 | JP6.4 R11.1 98.96,16.93 98.42,17.46 94.61,17.46 91.76,14.61 83.5,14.61 78.11,20 78.11,27.62 v72.07,33.66 | U1.20 61.94,33.05 v62.23,33.34
  Bottom 0.254: v109.22,16.51 JP6.4 | v72.07,33.66 62.55,33.66 v62.23,33.34
SD_CD  (via drill 0.33)
  Top 0.254: X4.CD1 90.66,53.83 81.53,44.7 X5.CD 81.53,39.62 80.33,38.42 80.33,32.7 v80.01,32.38 | U1.28 57.94,29.69 59.05,28.57 62.87,28.57 66.67,32.38 v67.94,32.38
  Bottom 0.254: v80.01,32.38 v67.94,32.38
SD_MISO  (via drill 0.33)
  Top 0.254: X4.7 90.37,65.84 95.25,60.96 v95.25,50.8 95.25,48.26 90.7,43.71 X5.7 | X5.7 90.7,37.78 | X5.7 90.7,39.9 88.9,38.1 88.9,33.02 v87.63,31.75 | U1.35 63.08,28.15 66.67,31.75 v66.99,31.75
  Top 0.406: 90.7,37.78 R14.1
  Bottom 0.254: v87.63,31.75 v66.99,31.75 | JP5.4 93.98,52.07 v95.25,50.8
SD_MOSI  (via drill 0.33)
  Top 0.254: X4.3 85.97,60.57 78.28,52.88 v78.28,48.26 X5.2 78.28,37.82 | R15.1 78.32,37.68 77.47,36.83 77.47,33.02 80.01,30.48 v80.01,23.81 | v56.83,21.91 56.94,21.8 U1.51
  Top 0.406: 78.28,37.82 R15.1
  Bottom 0.254: JP5.6 77.01,49.53 v78.28,48.26 | v80.01,23.81 79.69,23.5 64.45,23.5 63.18,22.23 57.15,22.23 v56.83,21.91
SD_SCK  (via drill 0.33)
  Top 0.254: X4.5 88.17,65.5 93.98,59.69 93.98,52.07 v87.63,45.72 85.78,43.87 X5.5 85.78,39.95 87.63,38.1 87.63,34.29 v86.36,33.02 | U1.18 62.94,32.14 v63.82,33.02
  Bottom 0.254: v86.36,33.02 v63.82,33.02 | JP5.5 64.77,45.72 v87.63,45.72
SD_SSEL  (via drill 0.33)
  Top 0.254: U1.30 56.94,32.91 v55.4,34.45 54.93,34.92 41.27,34.92 JP7.5 | 75.78,37.78 X5.1 75.78,52.92 84.87,62.01 X4.2 | 75.78,37.78 R13.1 | 75.78,37.78 67.63,37.78 v64.77,40.64
  Bottom 0.254: v64.77,40.64 61.59,40.64 v55.4,34.45
SD_WP  (via drill 0.33)
  Top 0.254: X5.WP 95.55,37.13 85.09,26.67 v85.09,22.86 | U1.3 67.2,22.65 v67.31,22.54
  Bottom 0.254: v67.31,22.54 67.63,22.23 84.45,22.23 v85.09,22.86
SDA  (via drill 0.33)
  Top 0.254: JP6.3 R3.1 98.96,14.39 98.42,14.92 93.66,14.92 92.71,13.97 83.19,13.97 77.47,19.68 77.47,27.3 v70.48,34.29 | v61.91,34.29 61.44,33.82 U1.21
  Bottom 0.254: PCB1.6 111.22,11.97 109.22,13.97 JP6.3 | v70.48,34.29 v61.91,34.29
SSEL  (via drill 0.33)
  Top 0.254: U1.13 57.49,27.65 v55.56,25.72
  Bottom 0.254: JP3.3 2.54,39.37 2.54,36.83 13.97,25.4 19.05,25.4 21.27,23.18 47.62,23.18 48.58,24.13 53.98,24.13 v55.56,25.72
SSEL1  (via drill 0.33)
  Top 0.254: U1.24 59.94,32 60.33,32.38 60.33,36.2 v60.96,36.83 | JP5.3 58.42,49.53 58.42,46.04 62.55,41.91 v62.55,39.37
  Bottom 0.254: v62.55,39.37 62.55,38.42 v60.96,36.83
TXD  (via drill 0.33)
  Top 0.254: U1.62 62.44,11.86 v63.18,11.11
  Bottom 0.254: v63.18,11.11 62.23,12.06 34.29,12.06 33.34,13.02 33.34,16.19 31.75,17.78 JP4.5
USB_CONNECT
  Top 0.254: R8.1 34.29,52.92 51.65,35.56 55.56,35.56 57.44,33.68 U1.29
USB_CONNECT_BASE
  Top 0.254: Q1.1 22.69,51.22 R9.1 R8.2
USB_CONNECT_COLLECTOR
  Top 0.254: Q1.3 20.49,52.32 R2.1
USB_DM
  Top 0.254: U1.25 59.44,37.08 57.53,38.99 R6.1 C4.1
USB_DP
  Top 0.254: U1.26 58.94,36.79 57.27,38.45 R7.1 C3.1
USB_ID
  Top 0.406: X3.4 5.09,56.5 5.25,56.35 X2.ID
USB_KEEPOUT
  cutout Top: 58.1,30.48 60.33,30.48 60.33,37.47 37.47,60.33 7.62,60.33 6.99,59.69 6.99,57.15 7.62,56.52 9.53,56.52 10.16,55.88 12.06,55.88 12.7,56.52 19.68,56.52 20.95,57.78 36.51,57.78 58.1,36.2
USB_VBUS  (via drill 0.33)
  Top 0.254: U1.19 62.44,32.28 63.18,33.02 63.18,36.51 60.96,38.73 60.96,41.91 52.7,50.16 v49.53,50.16
  Top 0.406: R10.1 v19.68,50.48
  Bottom 0.254: v19.68,50.48 49.21,50.48 v49.53,50.16
VBUS  (via drill 0.33)
  Top 0.406: X3.1 4.79,58.45 5.09,58.75 X2.VBUS 6.99,58.79 v6.99,59.69
  Bottom 0.406: X1.VBUS 12.14,55.32 11.11,54.29 7.62,54.29 6.99,54.93 v6.99,59.69
  pour Top (isolate 0.254): 11.43,57.78 16.51,57.78 16.51,56.2 20,52.7 20,45.09 19.37,44.45 12.7,44.45 11.43,45.72
VI2C  (via drill 0.6)
  Top 0.406: R12.2 v95.89,19.05 | R11.2 v95.89,16.51 | R3.2 v95.89,13.97 95.89,13.34 96.52,12.7 100.33,12.7 100.97,12.06 | 100.97,12.06 JP6.1 96.52,8.89 95.25,7.62 SJ2.2 | C9.1 100.33,11.43 100.97,12.06
  Bottom 0.406: v95.89,19.05 v95.89,16.51 v95.89,13.97
VIN
  pour Top (isolate 0.254): 1.91,27.94 1.91,30.48 3.17,31.75 11.43,31.75 16.19,36.51 18.1,36.51 19.05,35.56 19.05,33.02 13.97,27.94
VUART
  Top 0.406: SJ1.2 JP4.3
XTALIN
  Top 0.254: C15.2 72.61,21.49 Y1.1 72.38,21.92 71.75,22.54 70.48,22.54 70.17,22.86 70.17,24.13 69.15,25.15 U1.8
XTALOUT
  Top 0.254: Y1.3 70.91,23.59 C16.2 70.34,25.65 U1.9

### Text on the board
tPlace: Smoothiepanel | Prototype 3 | http://smoothieware.org/smoothiepanel | ... P1.15 | uUSB | designed by Logxen with the help | of the RepRap community | 5V | 3.3V | GND | 3.3V | NC | SSEL | MISO | P1.8 ... | GND | SCK | MOSI | SPI PINOUT | P0.23 | P0.7/SD_SSEL | P0.22 | P1.16/DAC_SDA | P1.17/DAC_SCL | ... P0.16 | 5V | GND | 3.3V | 3.3V | NC | +5V | GND | P0.11 ... | -GND | INT | TXD | SCL | RXD | 3.3V | SDA | GND | VUART | VUART | 5V | VI2C | GND | 5V | 3.3V | GND | 3.3V | VO | RS | R/W | EN | D0 | D1 | D2 | D3 | D4 | D5 | D6 | D7 | PSB | NC | RST | VOUT | BL+ | R- | G- | B- | VI2C | Nunchuck
bPlace: Prototype 3 | Smoothiepanel | http://smoothieware.org/smoothiepanel | ... P1.15 | designed by Logxen with the help | of the RepRap community | 3.3V | GND | W2 | 5V | SSEL | MISO | SPI1 | 3.3V | NC | SCK | MOSI | P1.8 ... | JP5 | GND | P0.23 | 3.3V | GND | SPI0 | P0.7/SD_SSEL | P0.22 | ... P0.16 | SSEL | MISO | P1.16/DAC_SDA | JP5 | SCK | MOSI | P1.17/DAC_SCL | EXT | 5V | GND | W1 | 3.3V | 3.3V | VIN | JP7 | NC | +5V | P0.11 ... | GND | JP2 | -GND | I2C | JP6 | INT | TXD | SCL | RXD | SDA | /INT | UART | GND | VUART | VI2C | GND | JP4 | GND | 3.3V | VO | RS | R/W | EN | D0 | D1 | D2 | D3 | D4 | D5 | D6 | D7 | PSB | NC | RST | VOUT | BL+ | R- | G- | B- | JP1 | LCD | Nunchuck